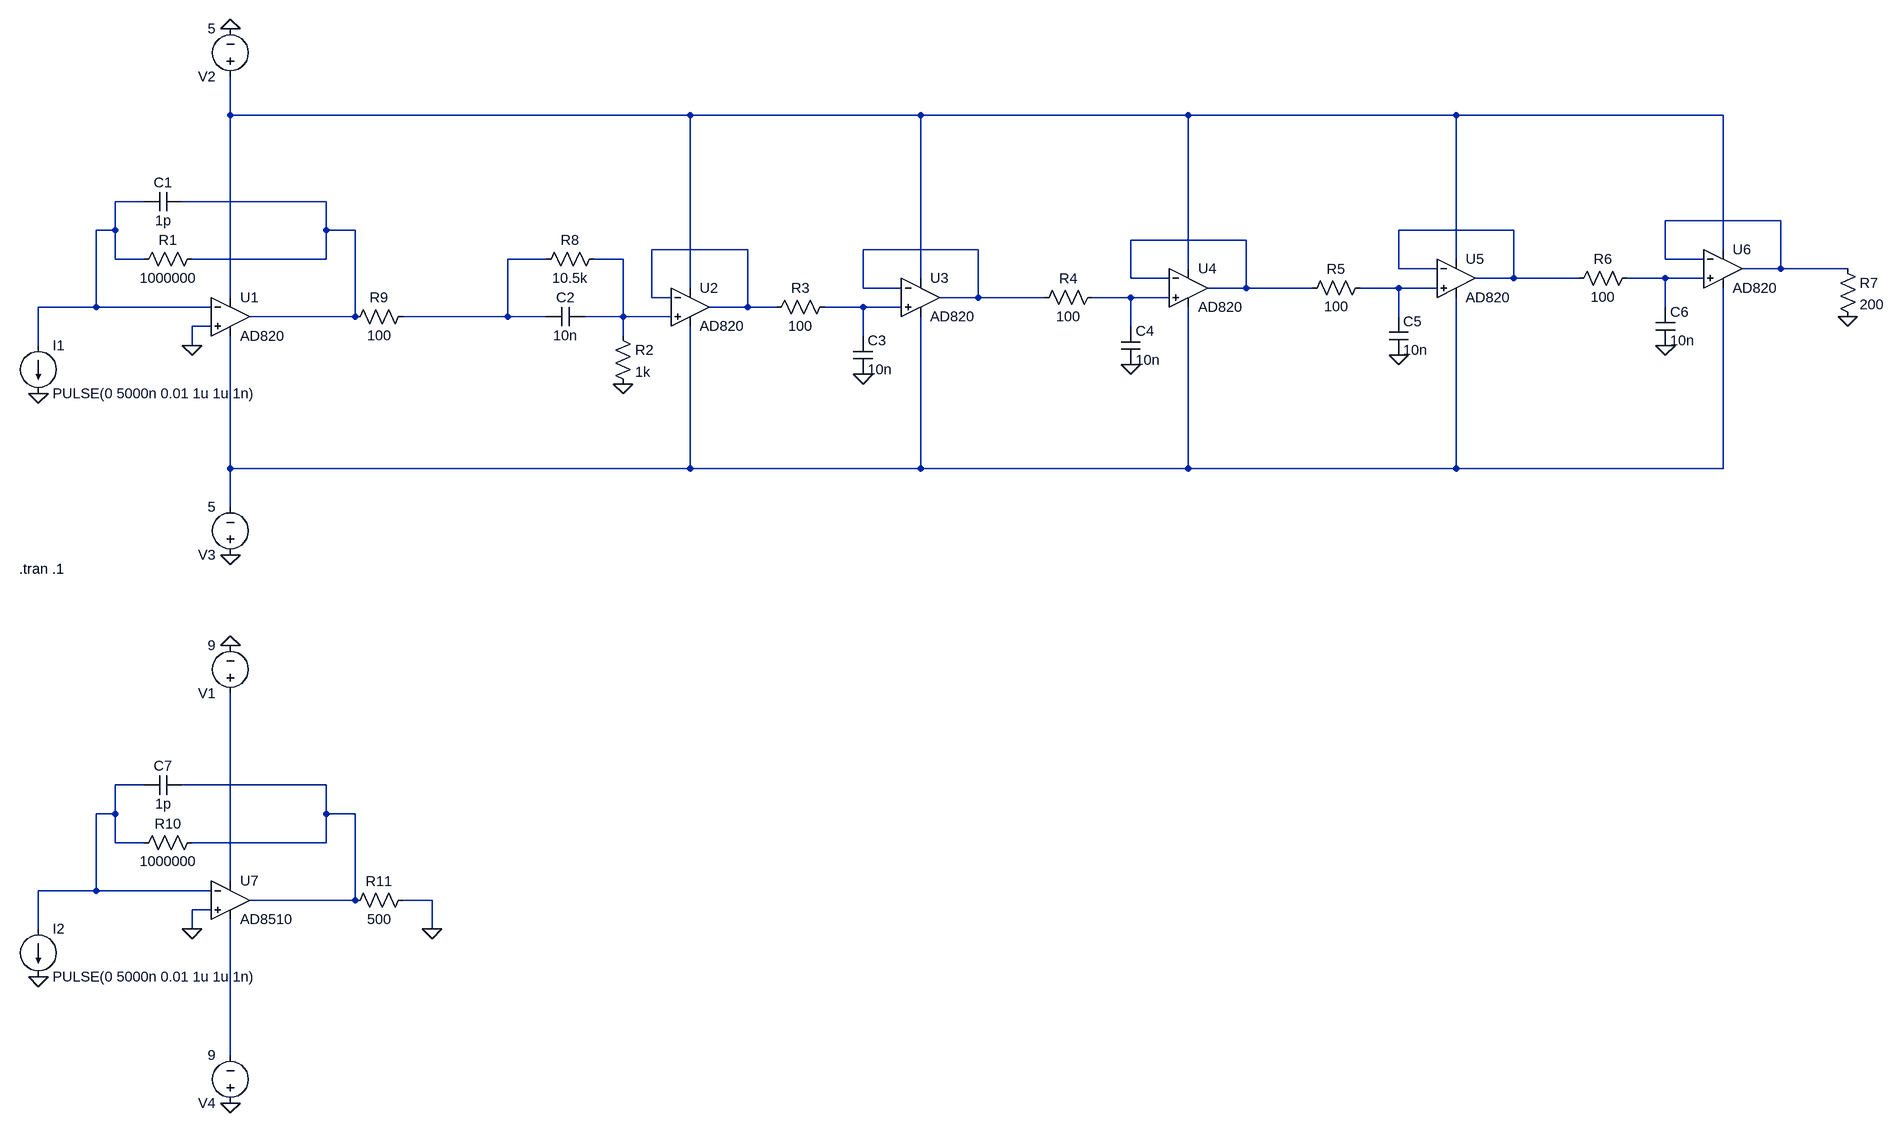
[diagram p0: schematic pulseShaperSimulation.asc]
pulseShaperSimulation.asc, the LTspice schematic file:
Version 4
SHEET 1 3636 1624
WIRE 544 -272 544 -336
WIRE 1632 -272 544 -272
WIRE 2016 -272 1632 -272
WIRE 2464 -272 2016 -272
WIRE 2912 -272 2464 -272
WIRE 3360 -272 2912 -272
WIRE 400 -128 352 -128
WIRE 704 -128 464 -128
WIRE 3456 -96 3264 -96
WIRE 352 -80 352 -128
WIRE 352 -80 320 -80
WIRE 704 -80 704 -128
WIRE 752 -80 704 -80
WIRE 3008 -80 2816 -80
WIRE 2560 -64 2368 -64
WIRE 1728 -48 1568 -48
WIRE 2112 -48 1920 -48
WIRE 3360 -48 3360 -272
WIRE 352 -32 352 -80
WIRE 400 -32 352 -32
WIRE 704 -32 704 -80
WIRE 704 -32 480 -32
WIRE 1392 -32 1328 -32
WIRE 1520 -32 1472 -32
WIRE 2912 -32 2912 -272
WIRE 3264 -32 3264 -96
WIRE 3328 -32 3264 -32
WIRE 2464 -16 2464 -272
WIRE 2816 -16 2816 -80
WIRE 2880 -16 2816 -16
WIRE 3456 -16 3456 -96
WIRE 3456 -16 3392 -16
WIRE 3568 -16 3456 -16
WIRE 2016 0 2016 -272
WIRE 2368 0 2368 -64
WIRE 2432 0 2368 0
WIRE 3008 0 3008 -80
WIRE 3008 0 2944 0
WIRE 3120 0 3008 0
WIRE 3264 0 3200 0
WIRE 3328 0 3264 0
WIRE 1632 16 1632 -272
WIRE 1920 16 1920 -48
WIRE 1984 16 1920 16
WIRE 2560 16 2560 -64
WIRE 2560 16 2496 16
WIRE 2672 16 2560 16
WIRE 2816 16 2752 16
WIRE 2880 16 2816 16
WIRE 544 32 544 -272
WIRE 1568 32 1568 -48
WIRE 1600 32 1568 32
WIRE 2112 32 2112 -48
WIRE 2112 32 2048 32
WIRE 2224 32 2112 32
WIRE 2368 32 2304 32
WIRE 2432 32 2368 32
WIRE 320 48 320 -80
WIRE 320 48 224 48
WIRE 512 48 320 48
WIRE 1728 48 1728 -48
WIRE 1728 48 1664 48
WIRE 1776 48 1728 48
WIRE 1920 48 1856 48
WIRE 1984 48 1920 48
WIRE 3264 48 3264 0
WIRE 752 64 752 -80
WIRE 752 64 576 64
WIRE 1328 64 1328 -32
WIRE 1328 64 832 64
WIRE 1392 64 1328 64
WIRE 1520 64 1520 -32
WIRE 1520 64 1456 64
WIRE 1600 64 1520 64
WIRE 2816 64 2816 16
WIRE 512 80 480 80
WIRE 2368 80 2368 32
WIRE 1520 96 1520 64
WIRE 1920 96 1920 48
WIRE 224 112 224 48
WIRE 480 112 480 80
WIRE 544 352 544 96
WIRE 1632 352 1632 80
WIRE 1632 352 544 352
WIRE 2016 352 2016 64
WIRE 2016 352 1632 352
WIRE 2464 352 2464 48
WIRE 2464 352 2016 352
WIRE 2912 352 2912 32
WIRE 2912 352 2464 352
WIRE 3360 352 3360 16
WIRE 3360 352 2912 352
WIRE 544 416 544 352
WIRE 400 960 352 960
WIRE 704 960 464 960
WIRE 352 1008 352 960
WIRE 352 1008 320 1008
WIRE 704 1008 704 960
WIRE 752 1008 704 1008
WIRE 352 1056 352 1008
WIRE 400 1056 352 1056
WIRE 704 1056 704 1008
WIRE 704 1056 480 1056
WIRE 544 1120 544 752
WIRE 320 1136 320 1008
WIRE 320 1136 224 1136
WIRE 512 1136 320 1136
WIRE 752 1152 752 1008
WIRE 752 1152 576 1152
WIRE 880 1152 832 1152
WIRE 512 1168 480 1168
WIRE 224 1200 224 1136
WIRE 480 1200 480 1168
WIRE 880 1200 880 1152
WIRE 544 1504 544 1184
FLAG 544 -416 0
FLAG 544 496 0
FLAG 1520 176 0
FLAG 1920 160 0
FLAG 2368 144 0
FLAG 2816 128 0
FLAG 3264 112 0
FLAG 3568 64 0
FLAG 480 112 0
FLAG 224 192 0
FLAG 544 672 0
FLAG 544 1584 0
FLAG 480 1200 0
FLAG 224 1280 0
FLAG 880 1200 0
SYMBOL Opamps\\AD820 544 0 R0
SYMATTR InstName U1
SYMBOL voltage 544 -320 R180
WINDOW 123 0 0 Left 0
WINDOW 39 0 0 Left 0
SYMATTR InstName V2
SYMATTR Value 5
SYMBOL voltage 544 512 R180
WINDOW 123 0 0 Left 0
WINDOW 39 0 0 Left 0
SYMATTR InstName V3
SYMATTR Value 5
SYMBOL Opamps\\AD820 1632 -16 R0
SYMATTR InstName U2
SYMBOL Opamps\\AD820 2016 -32 R0
SYMATTR InstName U3
SYMBOL res 1504 80 R0
SYMATTR InstName R2
SYMATTR Value 1k
SYMBOL res 1872 32 R90
WINDOW 0 0 56 VBottom 2
WINDOW 3 32 56 VTop 2
SYMATTR InstName R3
SYMATTR Value 100
SYMBOL cap 1904 96 R0
SYMATTR InstName C3
SYMATTR Value 10n
SYMBOL Opamps\\AD820 2464 -48 R0
SYMATTR InstName U4
SYMBOL res 2320 16 R90
WINDOW 0 0 56 VBottom 2
WINDOW 3 32 56 VTop 2
SYMATTR InstName R4
SYMATTR Value 100
SYMBOL cap 2352 80 R0
SYMATTR InstName C4
SYMATTR Value 10n
SYMBOL Opamps\\AD820 2912 -64 R0
SYMATTR InstName U5
SYMBOL res 2768 0 R90
WINDOW 0 0 56 VBottom 2
WINDOW 3 32 56 VTop 2
SYMATTR InstName R5
SYMATTR Value 100
SYMBOL cap 2800 64 R0
SYMATTR InstName C5
SYMATTR Value 10n
SYMBOL Opamps\\AD820 3360 -80 R0
SYMATTR InstName U6
SYMBOL res 3216 -16 R90
WINDOW 0 0 56 VBottom 2
WINDOW 3 32 56 VTop 2
SYMATTR InstName R6
SYMATTR Value 100
SYMBOL cap 3248 48 R0
SYMATTR InstName C6
SYMATTR Value 10n
SYMBOL res 3552 -32 R0
SYMATTR InstName R7
SYMATTR Value 200
SYMBOL cap 1456 48 R90
WINDOW 0 0 32 VBottom 2
WINDOW 3 32 32 VTop 2
SYMATTR InstName C2
SYMATTR Value 10n
SYMBOL res 1488 -48 R90
WINDOW 0 0 56 VBottom 2
WINDOW 3 32 56 VTop 2
SYMATTR InstName R8
SYMATTR Value 10.5k
SYMBOL cap 400 -112 R270
WINDOW 0 32 32 VTop 2
WINDOW 3 0 32 VBottom 2
SYMATTR InstName C1
SYMATTR Value 1p
SYMBOL res 496 -48 R90
WINDOW 0 0 56 VBottom 2
WINDOW 3 32 56 VTop 2
SYMATTR InstName R1
SYMATTR Value 1000000
SYMBOL current 224 112 R0
WINDOW 123 0 0 Left 0
WINDOW 39 0 0 Left 0
SYMATTR InstName I1
SYMATTR Value PULSE(0 5000n 0.01 1u 1u 1n)
SYMBOL res 848 48 R90
WINDOW 0 0 56 VBottom 2
WINDOW 3 32 56 VTop 2
SYMATTR InstName R9
SYMATTR Value 100
SYMBOL Opamps\\AD8510 544 1088 R0
SYMATTR InstName U7
SYMBOL voltage 544 768 R180
WINDOW 123 0 0 Left 0
WINDOW 39 0 0 Left 0
SYMATTR InstName V1
SYMATTR Value 9
SYMBOL voltage 544 1600 R180
WINDOW 123 0 0 Left 0
WINDOW 39 0 0 Left 0
SYMATTR InstName V4
SYMATTR Value 9
SYMBOL cap 400 976 R270
WINDOW 0 32 32 VTop 2
WINDOW 3 0 32 VBottom 2
SYMATTR InstName C7
SYMATTR Value 1p
SYMBOL res 496 1040 R90
WINDOW 0 0 56 VBottom 2
WINDOW 3 32 56 VTop 2
SYMATTR InstName R10
SYMATTR Value 1000000
SYMBOL current 224 1200 R0
WINDOW 123 0 0 Left 0
WINDOW 39 0 0 Left 0
SYMATTR InstName I2
SYMATTR Value PULSE(0 5000n 0.01 1u 1u 1n)
SYMBOL res 848 1136 R90
WINDOW 0 0 56 VBottom 2
WINDOW 3 32 56 VTop 2
SYMATTR InstName R11
SYMATTR Value 500
TEXT 192 520 Left 2 !.tran .1

The netlist it stands for:
* pulseShaperSimulation.asc
XU1 0 N002 N001 N015 N003 AD820  ; pins In+ In- V+ V- OUT
V2 N001 0 5
V3 0 N015 5
XU2 N010 N007 N001 N015 N007 AD820  ; pins In+ In- V+ V- OUT
XU3 N014 N008 N001 N015 N008 AD820  ; pins In+ In- V+ V- OUT
R2 N010 0 1k
R3 N014 N007 100
C3 N014 0 10n
XU4 N013 N006 N001 N015 N006 AD820  ; pins In+ In- V+ V- OUT
R4 N013 N008 100
C4 N013 0 10n
XU5 N012 N005 N001 N015 N005 AD820  ; pins In+ In- V+ V- OUT
R5 N012 N006 100
C5 N012 0 10n
XU6 N011 N004 N001 N015 N004 AD820  ; pins In+ In- V+ V- OUT
R6 N011 N005 100
C6 N011 0 10n
R7 N004 0 200
C2 N010 N009 10n
R8 N010 N009 10.5k
C1 N002 N003 1p
R1 N003 N002 1000000
I1 N002 0 PULSE(0 5000n 0.01 1u 1u 1n)
R9 N009 N003 100
XU7 0 N016 N018 N019 N017 AD8510  ; pins In+ In- V+ V- OUT
V1 N018 0 9
V4 0 N019 9
C7 N016 N017 1p
R10 N017 N016 1000000
I2 N016 0 PULSE(0 5000n 0.01 1u 1u 1n)
R11 0 N017 500
.tran .1
.backanno
.end